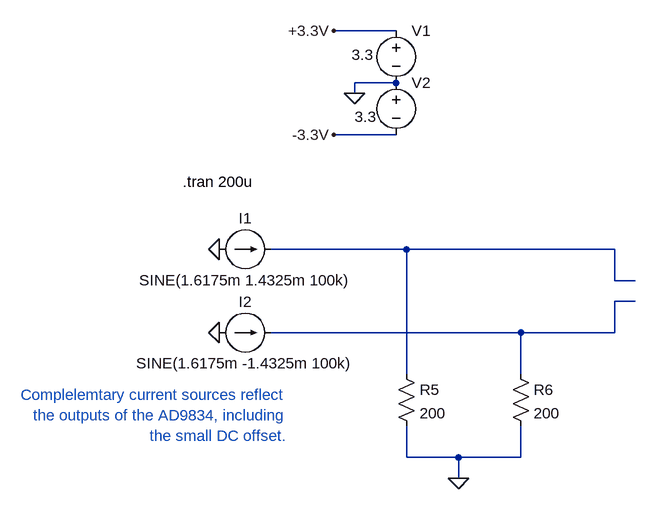
[diagram p0: schematic simplified-ad9834.asc]
simplified-ad9834.asc, the LTspice schematic file:
Version 4.1
SHEET 1 1876 1008
WIRE 416 -144 320 -144
WIRE 416 -64 352 -64
WIRE 352 -48 352 -64
WIRE 416 16 320 16
WIRE 432 192 224 192
WIRE 752 192 432 192
WIRE 752 240 752 192
WIRE 784 240 752 240
WIRE 784 272 752 272
WIRE 608 320 224 320
WIRE 752 320 752 272
WIRE 752 320 608 320
WIRE 432 384 432 192
WIRE 608 384 608 320
WIRE 432 512 432 464
WIRE 512 512 432 512
WIRE 608 512 608 464
WIRE 608 512 512 512
WIRE 512 544 512 512
FLAG 144 192 0
FLAG 144 320 0
FLAG 512 544 0
FLAG 352 -48 0
FLAG 320 -144 +3.3V
FLAG 320 16 -3.3V
SYMBOL current 144 192 R270
WINDOW 0 32 40 VTop 2
WINDOW 3 -32 40 VBottom 2
WINDOW 123 0 0 Left 0
WINDOW 39 0 0 Left 0
SYMATTR InstName I1
SYMATTR Value SINE(1.6175m 1.4325m 100k)
SYMBOL current 144 320 R270
WINDOW 0 32 40 VTop 2
WINDOW 3 -32 40 VBottom 2
WINDOW 123 0 0 Left 0
WINDOW 39 0 0 Left 0
SYMATTR InstName I2
SYMATTR Value SINE(1.6175m -1.4325m 100k)
SYMBOL res 416 368 R0
SYMATTR InstName R5
SYMATTR Value 200
SYMBOL res 592 368 R0
SYMATTR InstName R6
SYMATTR Value 200
SYMBOL voltage 416 -160 R0
WINDOW 3 -68 53 Left 2
WINDOW 123 0 0 Left 0
WINDOW 39 0 0 Left 0
SYMATTR Value 3.3
SYMATTR InstName V1
SYMBOL voltage 416 -80 R0
WINDOW 3 -64 68 Left 2
WINDOW 123 0 0 Left 0
WINDOW 39 0 0 Left 0
SYMATTR Value 3.3
SYMATTR InstName V2
TEXT 88 88 Left 2 !.tran 200u
TEXT 248 416 Right 2 ;Complelemtary current sources reflect\nthe outputs of the AD9834, including\nthe small DC offset.

The netlist it stands for:
* simplified-ad9834.asc
I1 0 N001 SINE(1.6175m 1.4325m 100k)
I2 0 N002 SINE(1.6175m -1.4325m 100k)
R5 N001 0 200
R6 N002 0 200
V1 +3.3V 0 3.3
V2 0 -3.3V 3.3
.tran 200u
* Complelemtary current sources reflect
* the outputs of the AD9834, including
* the small DC offset.
.backanno
.end